# Altium schematic sheet I2C-EXPANDER.SchDoc: =ProjectTitle
size 209 x 297 mm; Scale: 1:1; Address1: Address1; Address2: Address2; Address3: Address3; Address4: Address4; SheetNumber: 6; SheetTotal: 9; DocumentType: Схема электрическая принципиальная
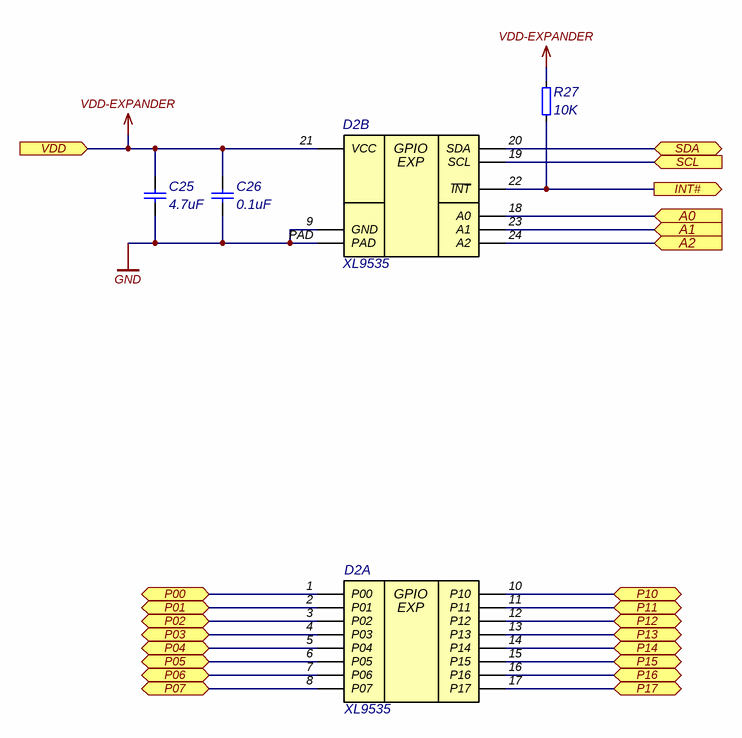
[diagram p0: I2C-EXPANDER.SchDoc]

## Parts
C25  4.7uF  [C0402]
C26  0.1uF  [C0402]
D2  XL9535  [QFN_24_4X4_E0p5]  (parts A,B of 2)
R27  10K  [R_0402]

## Ports
A0 (in), A1 (in), A2 (in), INT# (out), P00 (bidir), P01 (bidir), P02 (bidir), P03 (bidir), P04 (bidir), P05 (bidir), P06 (bidir), P07 (bidir), P10 (bidir), P11 (bidir), P12 (bidir), P13 (bidir), P14 (bidir), P15 (bidir), P16 (bidir), P17 (bidir), SCL (in), SDA (bidir), VDD (in)

## Nets
GND: C25.1 C26.1 D2.9(GND) D2.PAD
VDD-EXPANDER: C25.2 C26.2 D2.21(VCC) R27.2 ; port VDD
A0: D2.18(A0) ; port A0
A1: D2.23(A1) ; port A1
A2: D2.24(A2) ; port A2
INT#: D2.22(~{INT}) R27.1 ; port INT#
P00: D2.1(P00) ; port P00
P01: D2.2(P01) ; port P01
P02: D2.3(P02) ; port P02
P03: D2.4(P03) ; port P03
P04: D2.5(P04) ; port P04
P05: D2.6(P05) ; port P05
P06: D2.7(P06) ; port P06
P07: D2.8(P07) ; port P07
P10: D2.10(P10) ; port P10
P11: D2.11(P11) ; port P11
P12: D2.12(P12) ; port P12
P13: D2.13(P13) ; port P13
P14: D2.14(P14) ; port P14
P15: D2.15(P15) ; port P15
P16: D2.16(P16) ; port P16
P17: D2.17(P17) ; port P17
SCL: D2.19(SCL) ; port SCL
SDA: D2.20(SDA) ; port SDA

## Notes on the sheet
- Подп. и дата
- Инв. № дубл.
- Взам. инв. №
- Symbol name: =SheetSymbolDesignator
  File name: =DocumentName
  Variant name (Short): =ProjectVariant ( =ProjectBoardVariant )
  Version on board: =ProjectRevisionCode
- Инв. № подл.
- Изм.
- Лист
- № докум.
- Подп.
- Дата
- 2.106-A4
- Копировал
- Формат А4
- (in symbol XL9535QF24, part A) GPIO; EXP
- (in symbol XL9535QF24, part B) GPIO; EXP

## Library data of the parts
C25 = 0402-X5R-6.3V-4.7uF±20%: Manufacturer: Yageo; NameFromManufacturer: CC0402MRX5R5BB475; Place: S; Voltage: 6.3V; Tolerance: 20%; Check: False; Part Number: 0402-X5R-6.3V-4.7uF±20%; Value: 4.7uF; Temperature: -55°C~125°C; ComponentLink2Description: Link to datasheet; ComponentLink1Description: DATASHEET; ComponentLink2URL: https://ru.mouser.com/ProductDetail/YAGEO/CC0402MRX5R5BB475?qs=%2Fha2pyFadujQAk9rG2cgJpeZ0BKEEZe0MyMZqMwsns5cG502XdwDVw%3D%3D; ComponentLink1URL: Datasheets/capacitors/UPY-GPHC_X5R_4V-to-50V_27.pdf; Last changed: 27.10.2022
C26 = 0402-X7R-16V-0.1uF±10%: Manufacturer: Yageo; NameFromManufacturer: CC0402JRX7R7BB104; Place: S; Voltage: 16V; Tolerance: 5%; Check: False; Annotation: *; Param: *; Value: 0.1uF; Part Number: 0402-X7R-16V-0.1uF±10%; Temperature: -55°C~125°C; ComponentLink1Description: DATASHEET; ComponentLink1URL: https://www.yageo.com/upload/media/product/productsearch/datasheet/mlcc/UPY-GPHC_X7R_6.3V-to-50V_18.pdf; Datasheet: #https://www.yageo.com/upload/media/product/productsearch/datasheet/mlcc/UPY-GPHC_X7R_6.3V-to-50V_18.pdf#; Last changed: 31.03.2021
D2 = XL9535QF24: I2C  I/O Expander 16 bit; Manufacturer: XINLUDA; Place: T; Analog: TCA9535RTWR; Check: False; Part Number: XL9535QF24; Temperature: -40°C~85°C; Value: XL9535; ComponentLink1Description: DATASHEET; NameFromManufacturer: XL9535QF24; ComponentLink1URL: https://datasheet.lcsc.com/lcsc/2304251416_XINLUDA-XL9535QF24_C5444301.pdf; Last changed: 17.10.2023
R27 = 0402-0.0625W-10K-100ppm±1%: NameFromManufacturer: RC0402FR-0710KL; Manufacturer: Yageo; Place: S; Tolerance: 1%; Check: False; Part Number: 0402-0.0625W-10K-100ppm±1%; Value: 10K; Temperature: -55°C~155°C; ComponentLink1Description: DATASHEET; ComponentLink1URL: https://ru.mouser.com/ProductDetail/YAGEO/RC0402FR-0710KL?qs=%2Fha2pyFaduhjtLcYvKXQ8IogF7YwN7YtH%252BOO8ZtEEMnoa4yoWYcwpw%3D%3D; Datasheet: Datasheets/resistors/PYu-RC_Group_51_RoHS_L_11.pdf; Last changed: 27.10.2022